# Altium schematic sheet Rail_Protection_BP.SchDoc
size A4; Organization: UltraZohm; SheetNumber: 40BP
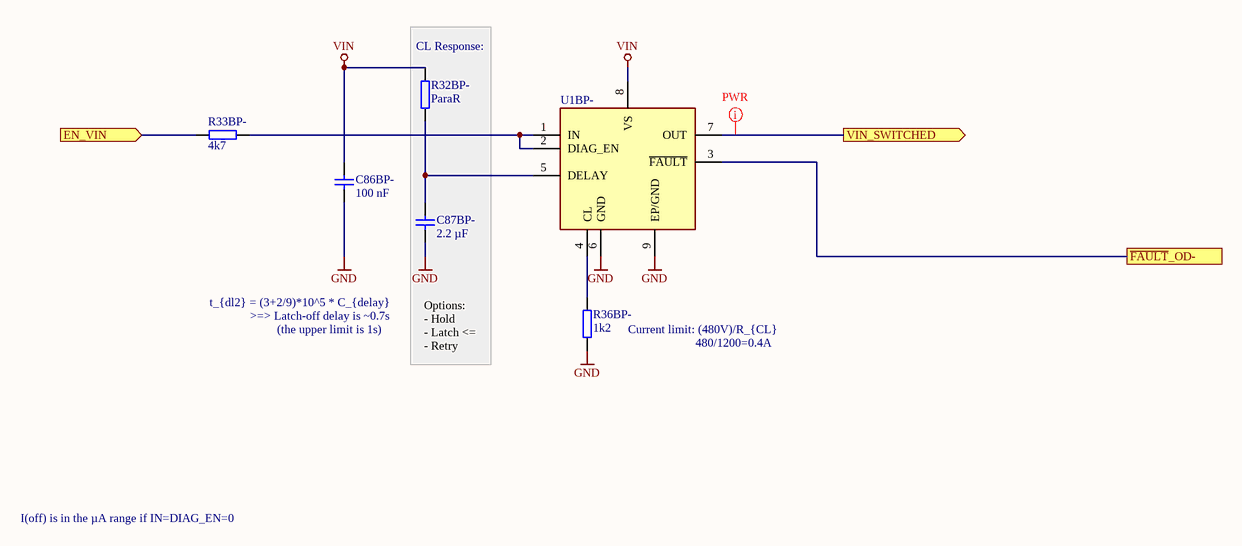
[diagram p0: Rail_Protection_BP.SchDoc]

## Parts
C86BP-  100 nF  [C_0603_TE]
C87BP-  2.2 µF  [C_0603_TE]
R32BP-  ParaR  [R_0603_TE]
R33BP-  4k7  [R_0603_TE]
R36BP-  1k2  [R_0603_TE]
U1BP-  TPS1H000AQDGNRQ1  [SOP65P490X110-9N]  (value not drawn)

## Blocks framed on the sheet
CL Response:: C87BP- R32BP-

## Ports
EN_VIN (in), VIN_SWITCHED (out), ~{FAULT}_OD-

## Nets
GND: C86BP-.1 C87BP-.1 R36BP-.1 U1BP-.6(GND) U1BP-.9(EP/GND)
VIN: C86BP-.2 R32BP-.2 U1BP-.8(VS)
EN_VIN: R33BP-.1 ; port EN_VIN
~{FAULT}_OD-: U1BP-.3(~{FAULT}) ; port ~{FAULT}_OD-
VIN_SWITCHED: U1BP-.7(OUT) ; port VIN_SWITCHED
NetC87BP-_2: C87BP-.2 R32BP-.1 U1BP-.5(DELAY)
NetR33BP-_2: R33BP-.2 U1BP-.1(IN) U1BP-.2(DIAG_EN)
NetR36BP-_2: R36BP-.2 U1BP-.4(CL)

## Layout directives
net class PWR: VIN_SWITCHED

## Notes on the sheet
- t_{dl2} = (3+2/9)*10^5 * C_{delay}
- >=> Latch-off delay is ~0.7s
- (the upper limit is 1s)
- Options:
  - Hold
  - Latch <=
  - Retry
- (near R36BP-) Current limit: (480V)/R_{CL}
- 480/1200=0.4A
- I(off) is in the µA range if IN=DIAG_EN=0
- Title
- Revision:
- Design Engineer:
- Date:
- Project:
- Sheet
- of

## Library data of the parts
C86BP- = UZgen_C_0603_100nF_50V_X7R: Generic capacitor; Manufacturer: UZgen; Voltage: 50V; Tolerance: 10 %; Created from: AGeiger; Manufacturer Part Number: UZgen_C_0603_100nF_50V_X7R; PartID: 1; Created On: 02/07/2024 14:42:23; Value: 100 nF; Device Package: 0603; Technology: X7R; Mounting Type: SMD; Last Updated: 08/08/2024 15:01:15
C87BP- = UZgen_C_0603_2.2uF_50V_X7R: Generic capacitor; Manufacturer: UZgen; Voltage: 50V; Tolerance: 10 %; Created from: UZgenTool; Manufacturer Part Number: UZgen_C_0603_2.2uF_50V_X7R; PartID: 4317; Created On: 02/08/2024 11:18:10; Value: 2.2 µF; Device Package: 0603; Technology: X7R; Mounting Type: SMD; Last Updated: 02/08/2024 11:18:10
R32BP- = UZgen_R_0603_ParaR: Generic resistor (parametric); Manufacturer: UZgen; Tolerance: 1 %; Created from: UZgenTool; Manufacturer Part Number: UZgen_R_0603_ParaR; PartID: 588; Created On: 08/07/2024 14:34:30; Value: ParaR; Device Package: 0603; Mounting Type: SMD; Last Updated: 08/07/2024 14:34:30
R33BP- = UZgen_R_0603_4k7: Generic resistor; Manufacturer: UZgen; Tolerance: 1 %; Created from: UZgenTool; Manufacturer Part Number: UZgen_R_0603_4k7; PartID: 237; Created On: 02/07/2024 17:29:50; Value: 4k7; Device Package: 0603; Mounting Type: SMD; Last Updated: 02/07/2024 17:29:50
R36BP- = UZgen_R_0603_1k2: Generic resistor; Manufacturer: UZgen; Tolerance: 1 %; Created from: UZgenTool; Manufacturer Part Number: UZgen_R_0603_1k2; PartID: 223; Created On: 02/07/2024 17:29:49; Value: 1k2; Device Package: 0603; Mounting Type: SMD; Last Updated: 02/07/2024 17:29:49
U1BP- = TPS1H000AQDGNRQ1: Power Switch ICs - Power Distribution 40-V, 1-ohm, 1-ch automotive smart high-side switch with adjustable current limit 8-HVSSOP -40 to 125; Manufacturer: Texas Instruments; Created from: FRosner; Manufacturer Part Number: TPS1H000AQDGNRQ1; PartID: 7; Created On: 15/07/2024 07:35:11; ComponentLink1Description: Datasheet; ComponentLink1URL: https://www.ti.com/lit/ds/symlink/tps1h000-q1.pdf; Component Type: Power Switch ICs; Device Package: MSOP-PowerPad-8; Last Updated: 11/04/2025 15:13:45; Mounting Type: SMD; Operating Temperature: -40 to +125 °C; Series: TPS1H000-Q1; Supplier 1: Mouser; Supplier Part Number 1: 595-TPS1H000AQDGNRQ1; Supplier 2: LCSC; Supplier Part Number 2: C2653764; Value: TPS1H000AQDGNRQ1; LCSC Part Number: C2653764